# Altium schematic sheet RF_opamp.SchDoc
size A4; SheetNumber: 5; SheetTotal: 7
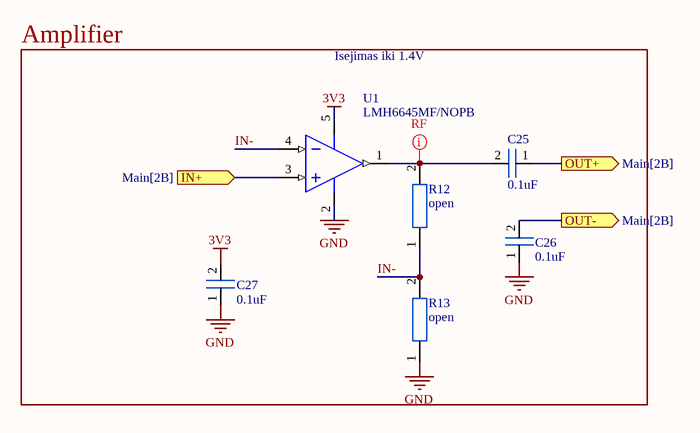
[diagram p0: RF_opamp.SchDoc]

## Parts
C25  0.1uF  [0402_footprint]
C26  0.1uF  [0402_footprint]
C27  0.1uF  [0402_footprint]
R12  open  [0402_footprint]
R13  open  [0402_footprint]
U1  LMH6645MF/NOPB  [DBV0005A_N]

## Ports
IN+ (in, see Main[2B]), OUT+ (out, see Main[2B]), OUT- (out, see Main[2B])

## Nets
3V3: C27.2 U1.5(V+)
GND: C26.1 C27.1 R13.1 U1.2(V-)
IN+: U1.3(IN+) ; port IN+
IN-: R12.1 R13.2 U1.4(IN-)
OUT+: C25.1 ; port OUT+
OUT-: C26.2 ; port OUT-
NetC25_2: C25.2 R12.2 U1.1(OUT)

## Layout directives
net class RF: NetC25_2

## Notes on the sheet
- Amplifier
- Isejimas iki 1.4V

## Library data of the parts
C25-C27 = Capacitor_0402: 0402 capacitor
R12 R13 = Resistor_0402
U1 = CMP-0055-01245-3: 2.7V, 650uA, 65MHz, Rail-to-Rail Input and Output Amplifiers with Shutdown Option, 5-pin SOT-23, Pb-Free; Manufacturer: Texas Instruments; PowerWise: Y; PackageTopMarking: A68A*XTT; Package Reference: DBV0005A; PackageDescription: Molded SOT-23, .115 x .063 x .040 in Body, 5 Lead, .0375 in Pitch; ComponentLink1URL: http://www.ti.com/general/docs/lit/getliterature.tsp?genericPartNumber=LMH6645&fileType=pdf; CompType: Amplifiers; PinCount: 5; RoHS: Y; ComponentLink1Description: Datasheet URL